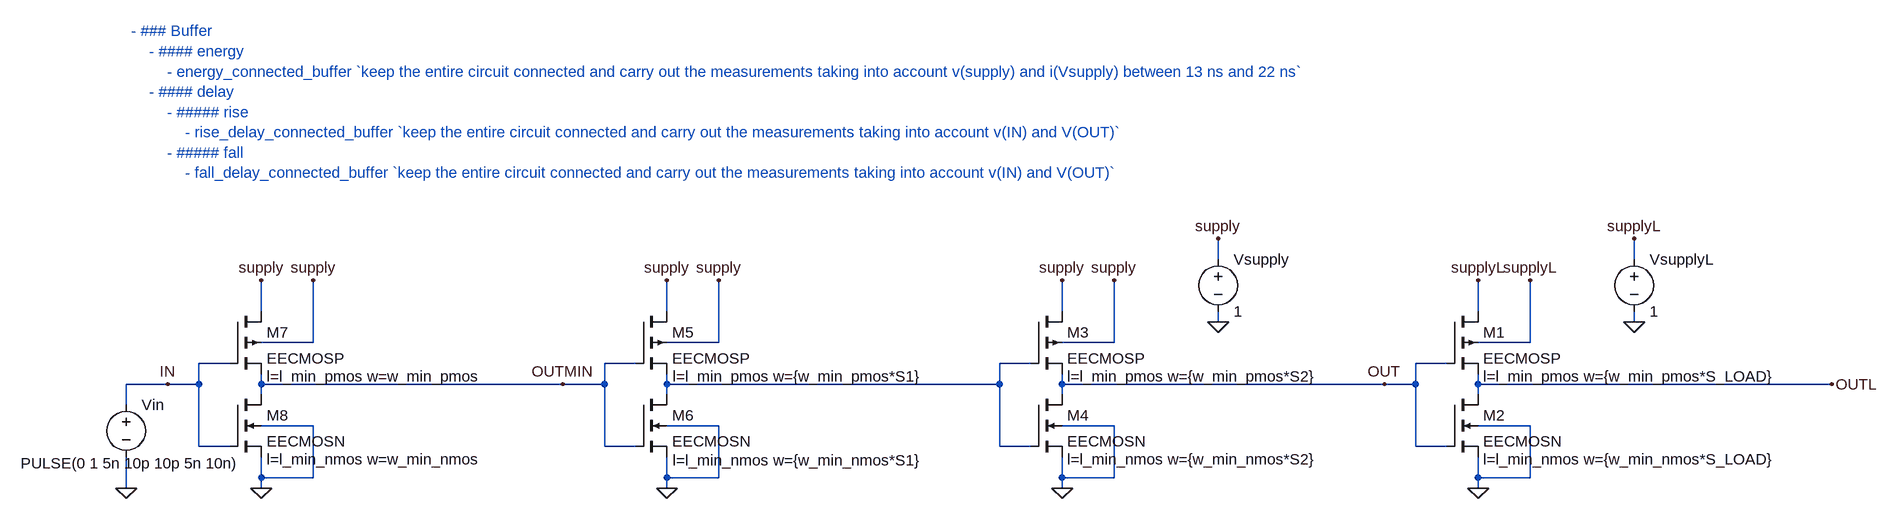
[diagram p0: schematic buffer_optimized.asc]
buffer_optimized.asc, the LTspice schematic file:
Version 4
SHEET 1 10852 948
WIRE 624 -32 624 -64
WIRE 1264 -32 1264 -64
WIRE -848 48 -848 0
WIRE -224 48 -224 0
WIRE 384 48 384 0
WIRE 1024 48 1024 0
WIRE 624 64 624 48
WIRE 1264 64 1264 48
WIRE -768 96 -768 0
WIRE -768 96 -848 96
WIRE -144 96 -144 0
WIRE -144 96 -224 96
WIRE 464 96 464 0
WIRE 464 96 384 96
WIRE 1104 96 1104 0
WIRE 1104 96 1024 96
WIRE -896 128 -944 128
WIRE -272 128 -320 128
WIRE 336 128 288 128
WIRE 976 128 928 128
WIRE -992 160 -1056 160
WIRE -944 160 -944 128
WIRE -944 160 -992 160
WIRE -848 160 -848 144
WIRE -384 160 -848 160
WIRE -320 160 -320 128
WIRE -320 160 -384 160
WIRE -224 160 -224 144
WIRE 288 160 288 128
WIRE 288 160 -224 160
WIRE 384 160 384 144
WIRE 880 160 384 160
WIRE 928 160 928 128
WIRE 928 160 880 160
WIRE 1024 160 1024 144
WIRE 1568 160 1024 160
WIRE -848 176 -848 160
WIRE -224 176 -224 160
WIRE 384 176 384 160
WIRE 1024 176 1024 160
WIRE -1056 192 -1056 160
WIRE -768 224 -848 224
WIRE -144 224 -224 224
WIRE 464 224 384 224
WIRE 1104 224 1024 224
WIRE -944 256 -944 160
WIRE -896 256 -944 256
WIRE -320 256 -320 160
WIRE -272 256 -320 256
WIRE 288 256 288 160
WIRE 336 256 288 256
WIRE 928 256 928 160
WIRE 976 256 928 256
WIRE -848 304 -848 272
WIRE -768 304 -768 224
WIRE -768 304 -848 304
WIRE -224 304 -224 272
WIRE -144 304 -144 224
WIRE -144 304 -224 304
WIRE 384 304 384 272
WIRE 464 304 464 224
WIRE 464 304 384 304
WIRE 1024 304 1024 272
WIRE 1104 304 1104 224
WIRE 1104 304 1024 304
WIRE -1056 320 -1056 272
WIRE -848 320 -848 304
WIRE -224 320 -224 304
WIRE 384 320 384 304
WIRE 1024 320 1024 304
FLAG 624 64 0
FLAG 1264 64 0
FLAG 624 -64 supply
FLAG 880 160 OUT
FLAG -1056 320 0
FLAG -992 160 IN
FLAG -848 320 0
FLAG 384 320 0
FLAG -224 320 0
FLAG 1024 320 0
FLAG -384 160 OUTMIN
FLAG 1264 -64 supplyL
FLAG 1568 160 OUTL
FLAG -848 0 supply
FLAG -768 0 supply
FLAG -224 0 supply
FLAG -144 0 supply
FLAG 384 0 supply
FLAG 464 0 supply
FLAG 1024 0 supplyL
FLAG 1104 0 supplyL
SYMBOL pmos4 976 48 R0
WINDOW 123 56 100 Left 2
SYMATTR Value2 l=l_min_pmos w={w_min_pmos*S_LOAD}
SYMATTR InstName M1
SYMATTR Value EECMOSP
SYMBOL nmos4 976 176 R0
WINDOW 123 56 100 Left 2
SYMATTR Value2 l=l_min_nmos w={w_min_nmos*S_LOAD}
SYMATTR InstName M2
SYMATTR Value EECMOSN
SYMBOL pmos4 336 48 R0
WINDOW 123 56 100 Left 2
SYMATTR Value2 l=l_min_pmos w={w_min_pmos*S2}
SYMATTR InstName M3
SYMATTR Value EECMOSP
SYMBOL nmos4 336 176 R0
WINDOW 123 56 100 Left 2
SYMATTR Value2 l=l_min_nmos w={w_min_nmos*S2}
SYMATTR InstName M4
SYMATTR Value EECMOSN
SYMBOL pmos4 -272 48 R0
WINDOW 123 57 100 Left 2
SYMATTR Value2 l=l_min_pmos w={w_min_pmos*S1}
SYMATTR InstName M5
SYMATTR Value EECMOSP
SYMBOL nmos4 -272 176 R0
WINDOW 123 57 101 Left 2
SYMATTR Value2 l=l_min_nmos w={w_min_nmos*S1}
SYMATTR InstName M6
SYMATTR Value EECMOSN
SYMBOL pmos4 -896 48 R0
WINDOW 123 56 100 Left 2
SYMATTR Value2 l=l_min_pmos w=w_min_pmos
SYMATTR InstName M7
SYMATTR Value EECMOSP
SYMBOL nmos4 -896 176 R0
WINDOW 123 56 100 Left 2
SYMATTR Value2 l=l_min_nmos w=w_min_nmos
SYMATTR InstName M8
SYMATTR Value EECMOSN
SYMBOL voltage 624 -48 R0
WINDOW 123 0 0 Left 0
WINDOW 39 0 0 Left 0
SYMATTR InstName Vsupply
SYMATTR Value 1
SYMBOL voltage 1264 -48 R0
WINDOW 123 0 0 Left 0
WINDOW 39 0 0 Left 0
SYMATTR InstName VsupplyL
SYMATTR Value 1
SYMBOL voltage -1056 176 R0
WINDOW 3 -162 106 Left 2
WINDOW 123 0 0 Left 0
WINDOW 39 0 0 Left 0
SYMATTR Value PULSE(0 1 5n 10p 10p 5n 10n)
SYMATTR InstName Vin
TEXT -1048 -384 Left 2 ;- ### Buffer\n    - #### energy\n        - energy_connected_buffer `keep the entire circuit connected and carry out the measurements taking into account v(supply) and i(Vsupply) between 13 ns and 22 ns`\n    - #### delay\n        - ##### rise\n            - rise_delay_connected_buffer `keep the entire circuit connected and carry out the measurements taking into account v(IN) and V(OUT)`\n        - ##### fall\n            - fall_delay_connected_buffer `keep the entire circuit connected and carry out the measurements taking into account v(IN) and V(OUT)`

The netlist it stands for:
* buffer_optimized.asc
M1 supplyL OUT OUTL supplyL EECMOSP l=l_min_pmos w={w_min_pmos*S_LOAD}
M2 OUTL OUT 0 0 EECMOSN l=l_min_nmos w={w_min_nmos*S_LOAD}
M3 supply N001 OUT supply EECMOSP l=l_min_pmos w={w_min_pmos*S2}
M4 OUT N001 0 0 EECMOSN l=l_min_nmos w={w_min_nmos*S2}
M5 supply OUTMIN N001 supply EECMOSP l=l_min_pmos w={w_min_pmos*S1}
M6 N001 OUTMIN 0 0 EECMOSN l=l_min_nmos w={w_min_nmos*S1}
M7 supply IN OUTMIN supply EECMOSP l=l_min_pmos w=w_min_pmos
M8 OUTMIN IN 0 0 EECMOSN l=l_min_nmos w=w_min_nmos
Vsupply supply 0 1
VsupplyL supplyL 0 1
Vin IN 0 PULSE(0 1 5n 10p 10p 5n 10n)
.model NMOS NMOS
.model PMOS PMOS
.lib standard.mos
* - ### Buffer
*     - #### energy
*         - energy_connected_buffer `keep the entire circuit connected and carry out the measurements taking into account v(supply) and i(Vsupply) between 13 ns and 22 ns`
*     - #### delay
*         - ##### rise
*             - rise_delay_connected_buffer `keep the entire circuit connected and carry out the measurements taking into account v(IN) and V(OUT)`
*         - ##### fall
*             - fall_delay_connected_buffer `keep the entire circuit connected and carry out the measurements taking into account v(IN) and V(OUT)`
.backanno
.end